# EAGLE design AD9914-shield (EAGLE 6.6.0)
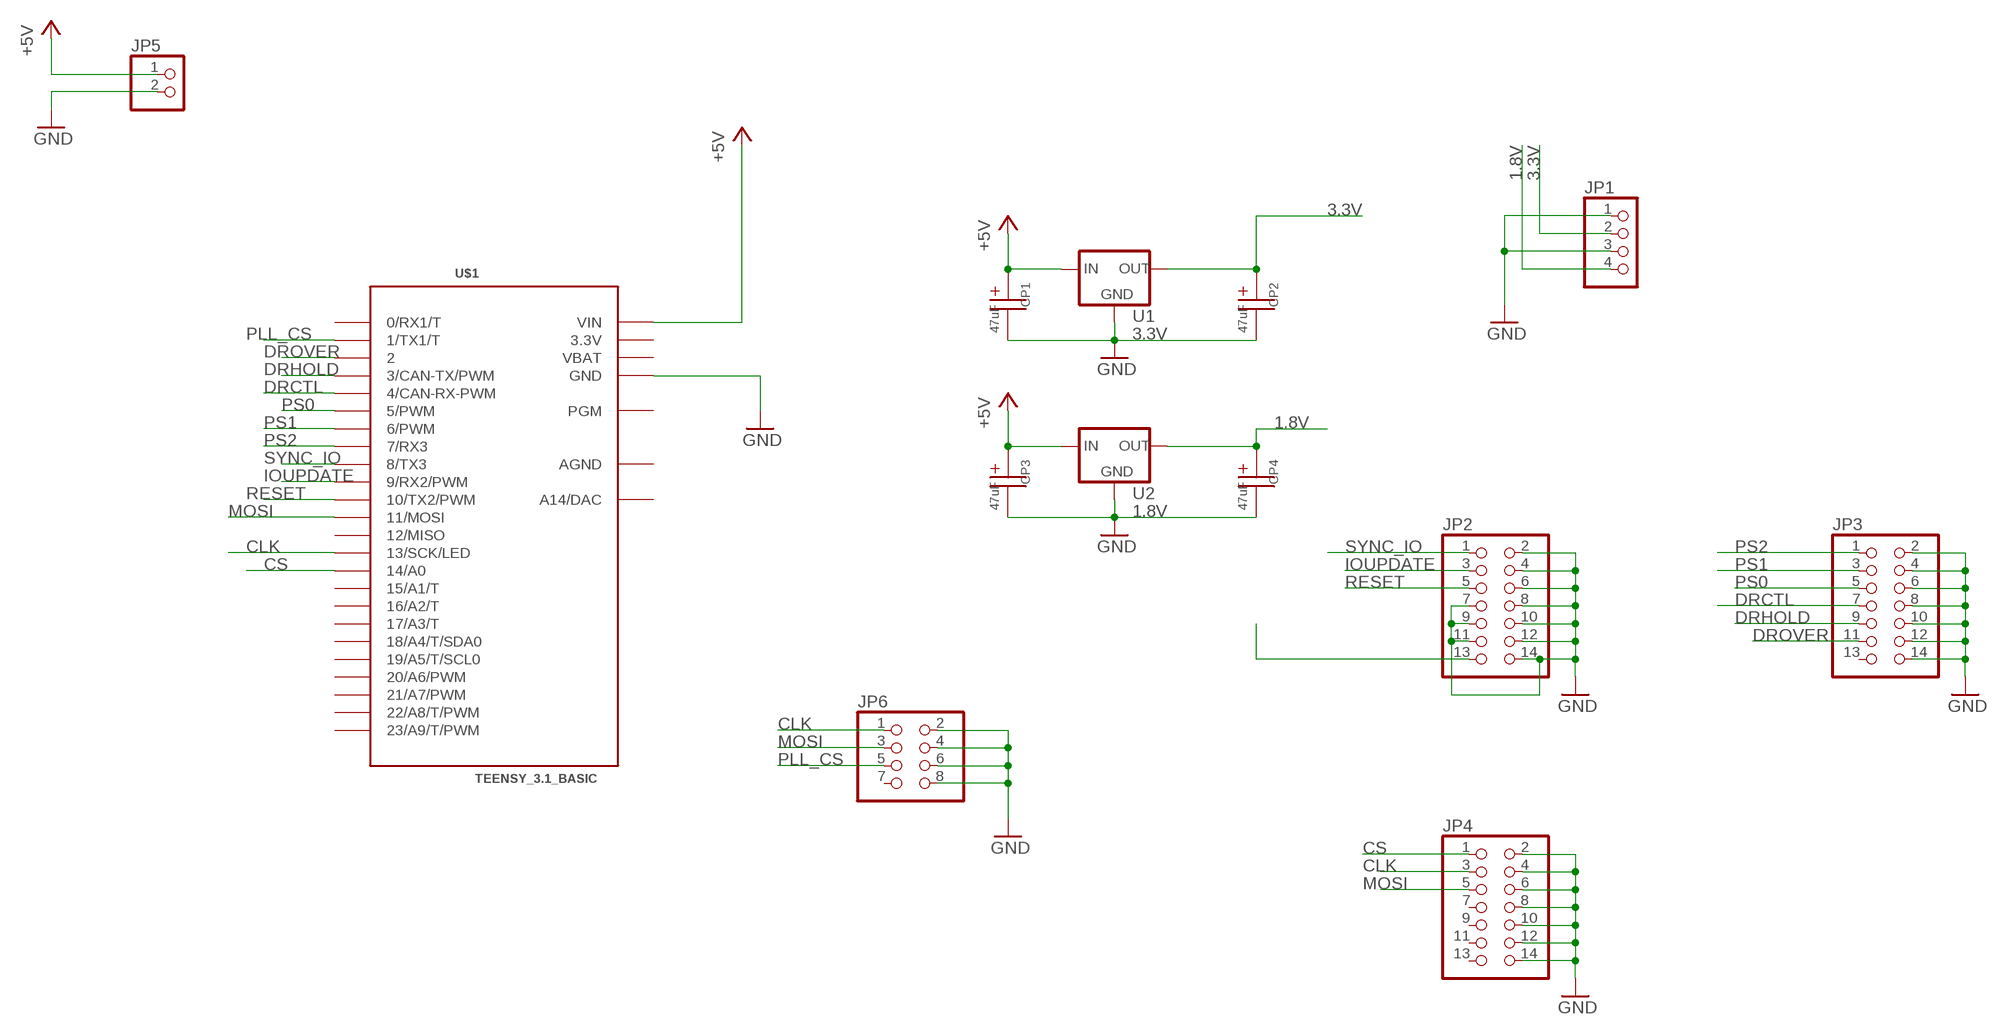
[diagram p0: schematic, sheet 1]

## Parts
CP1  47uF  CAP-POL2917  [2917P]
CP2  47uF  CAP-POL2917  [2917P]
CP3  47uF  CAP-POL2917  [2917P]
CP4  47uF  CAP-POL2917  [2917P]
JP1  PINHD-1X4  [1X04]
JP2  PINHD-2X7  [2X07]
JP3  PINHD-2X7  [2X07]
JP4  PINHD-2X7  [2X07]
JP5  PINHD-1X2  [1X02]
JP6  PINHD-2X4  [2X04]
U1  3.3V  LM1117-FIXED  [SOT223]
U2  1.8V  LM1117-FIXED  [SOT223]
U$1  TEENSY_3.1_BASIC  [TEENSY_3.1_BASIC]

## Nets
1.8V: CP4.+ JP1.4 U2.2(OUT) U2.4(OUT)
3.3V: CP2.+ JP1.2 JP2.13 U1.2(OUT) U1.4(OUT)
+5V: CP1.+ CP3.+ JP5.1 U1.3(IN) U2.3(IN) U$1.VIN
CLK: JP4.3 JP6.1 U$1.13(13/SCK/LED)
CS: JP4.1 U$1.14/A0
DRCTL: JP3.7 U$1.4(4/CAN-RX-PWM)
DRHOLD: JP3.9 U$1.3(3/CAN-TX/PWM)
DROVER: JP3.11 U$1.2
GND: CP1.- CP2.- CP3.- CP4.- JP1.1 JP1.3 JP2.2 JP2.4 JP2.6 JP2.7 JP2.8 JP2.9 JP2.10 JP2.11 JP2.12 JP2.14 JP3.2 JP3.4 JP3.6 JP3.8 JP3.10 JP3.12 JP3.14 JP4.2 JP4.4 JP4.6 JP4.8 JP4.10 JP4.12 JP4.14 JP5.2 JP6.2 JP6.4 JP6.6 JP6.8 U1.1(GND) U2.1(GND) U$1.GND U$1.GND1(GND)
IOUPDATE: JP2.3 U$1.9(9/RX2/PWM)
MOSI: JP4.5 JP6.3 U$1.11(11/MOSI)
PLL_CS: JP6.5 U$1.1(1/TX1/T)
PS0: JP3.5 U$1.5(5/PWM)
PS1: JP3.3 U$1.6(6/PWM)
PS2: JP3.1 U$1.7(7/RX3)
RESET: JP2.5 U$1.10(10/TX2/PWM)
SYNC_IO: JP2.1 U$1.8(8/TX3)
Unconnected: JP3.13 JP4.7 JP4.9 JP4.11 JP4.13 JP6.7 U$1.0(0/RX1/T) U$1.12(12/MISO) U$1.15/A1(15/A1/T) U$1.16/A2(16/A2/T) U$1.17/A3(17/A3/T) U$1.18/A4(18/A4/T/SDA0) U$1.19/A5(19/A5/T/SCL0) U$1.20/A6(20/A6/PWM) U$1.21/A7(21/A7/PWM) U$1.22/A8(22/A8/T/PWM) U$1.23/A9(23/A9/T/PWM) U$1.A14(A14/DAC) U$1.PGM

## Power pins joined to a net without a drawn wire
3.3V: U$1.3.3V U$1.3.3V1(3.3V)
AGND: U$1.AGND
VBAT: U$1.VBAT

## Library data of the parts
CP1-CP4 = rlc-jqi:CAP-POL: Polarized SMT Capacitor
JP1 = pinhead:PINHD-1X4: PIN HEADER
JP2-JP4 = pinhead:PINHD-2X7: PIN HEADER
JP5 = pinhead:PINHD-1X2: PIN HEADER
JP6 = pinhead:PINHD-2X4: PIN HEADER
U1 U2 = regulator-jqi:LM1117-FIXED
U$1 = mcu-accessories:TEENSY_3.1_BASIC: Footprint for Teensy 3.1 board using all pin connections on the outer perimeter

## Board
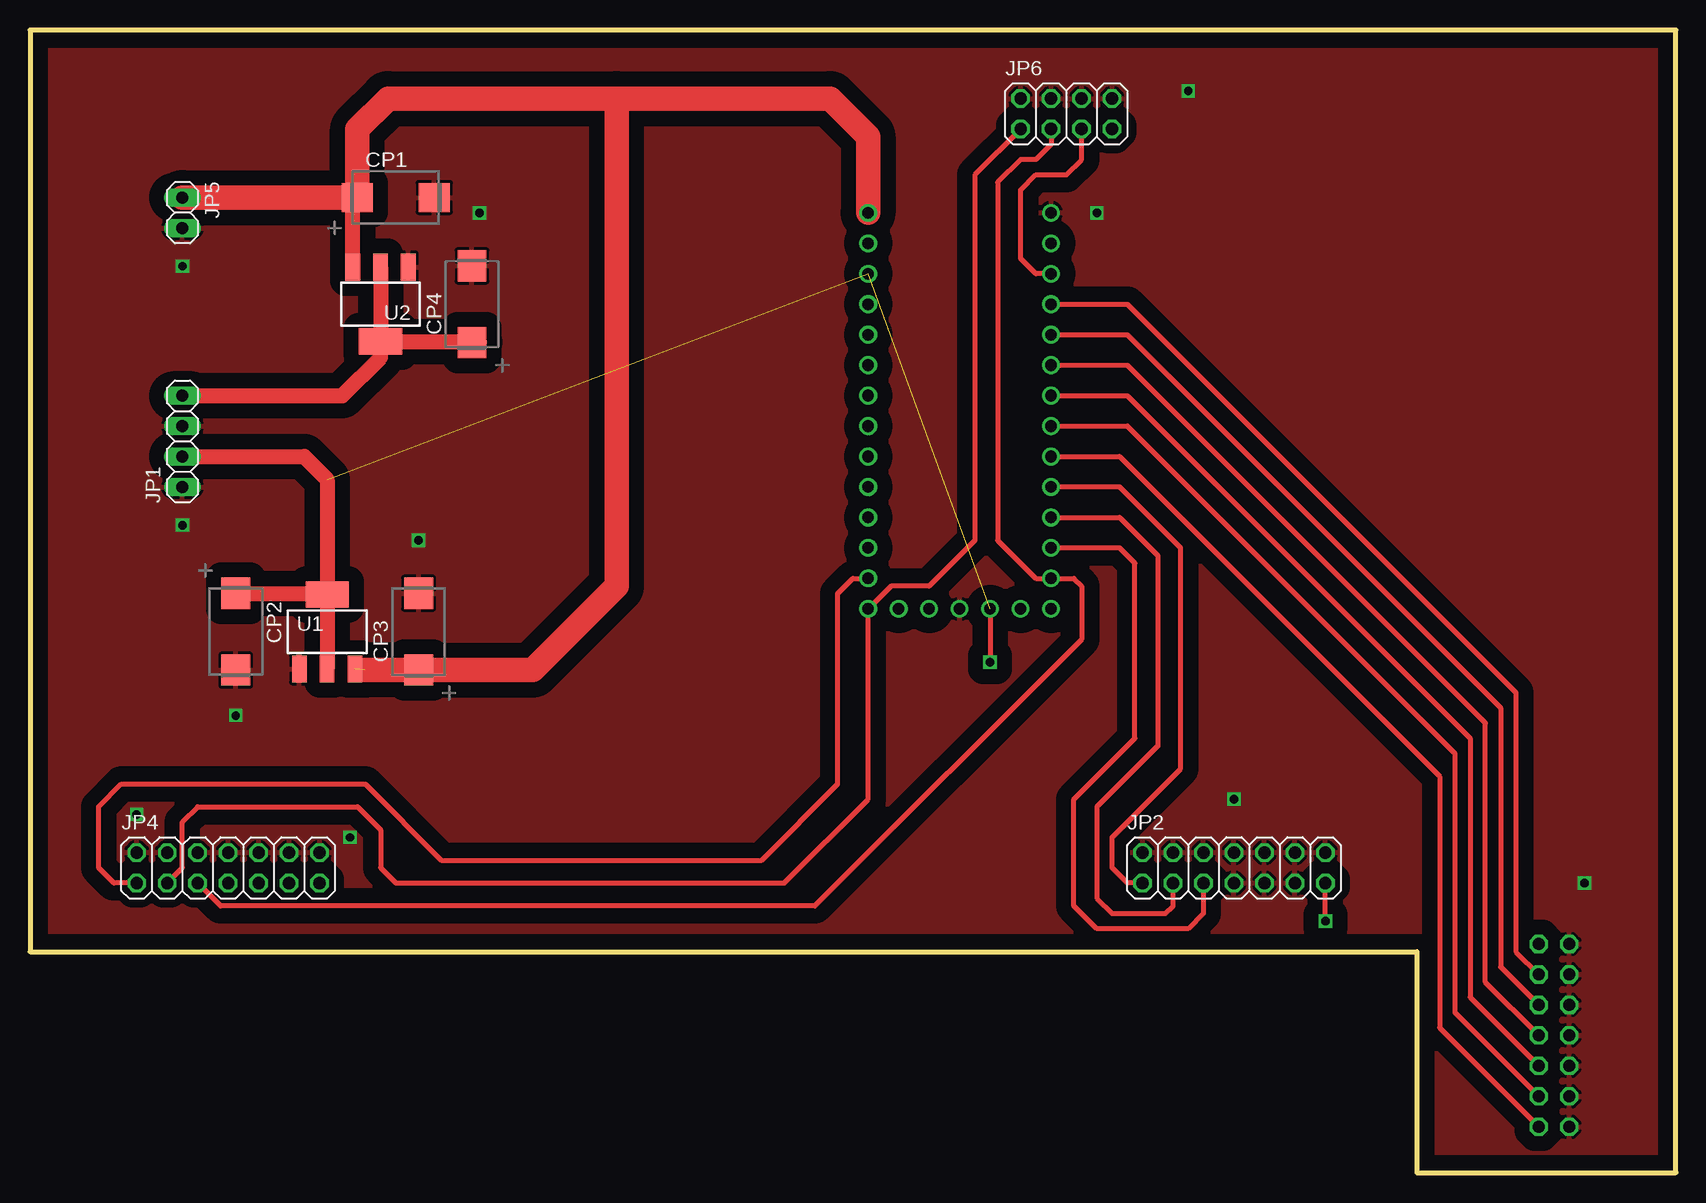
[diagram p1: board, top side]
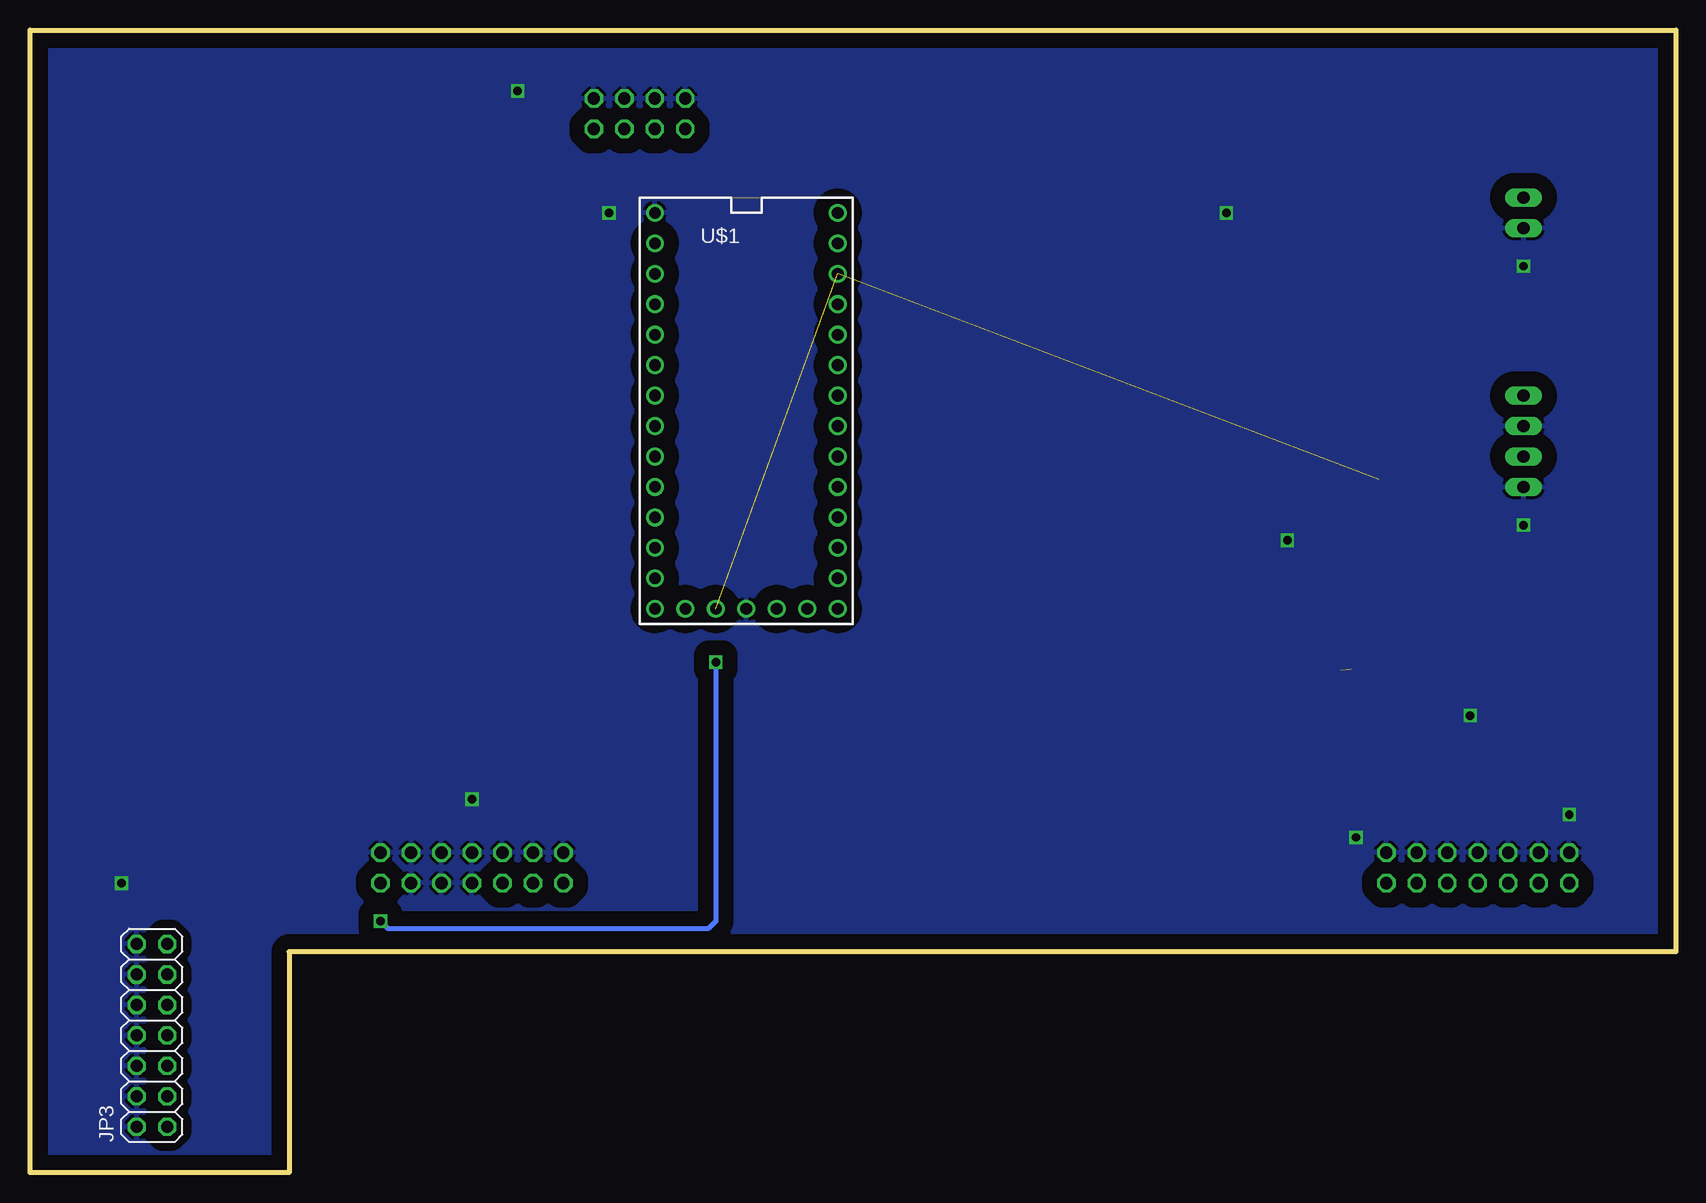
[diagram p2: board, bottom side, seen from below]

Size 137.16 x 95.25 mm. Coordinates in mm from the lower left corner, seen from the top.
Outline: 0,18.42 115.57,18.42 115.57,0 137.16,0 137.16,95.25 0,95.25 0,18.42
Copper layers (1*16): Top 0.035mm / dielectric 1.5mm / Bottom 0.035mm
Design rules "default": minimum track width 10mil, minimum drill 24mil, track to track 8mil, track to pad 8mil, pad to pad 8mil, via to via 8mil, smd to smd 8mil, copper to edge 40mil, drill to drill 8mil, minimum pad ring 10mil, minimum via ring 8mil, stop-mask expansion 4mil, vias tented up to drill 0mil, thermal gap 10mil

### Footprints (pad centres in the part's own frame; a part is rotated, then mirrored left to right if it is on the bottom)
2917P = smd 2.6 x 2.4: + -3.2,0; - 3.2,0
1X04 = drill 1.016 long: 1 -3.81,0; 2 -1.27,0; 3 1.27,0; 4 3.81,0
2X07 = drill 1.016 octagon: 1 -7.62,-1.27; 2 -7.62,1.27; 3 -5.08,-1.27; 4 -5.08,1.27; 5 -2.54,-1.27; 6 -2.54,1.27; 7 0,-1.27; 8 0,1.27; 9 2.54,-1.27; 10 2.54,1.27; 11 5.08,-1.27; 12 5.08,1.27; 13 7.62,-1.27; 14 7.62,1.27
1X02 = drill 1.016 long: 1 -1.27,0; 2 1.27,0
2X04 = drill 1.016 octagon: 1 -3.81,-1.27; 2 -3.81,1.27; 3 -1.27,-1.27; 4 -1.27,1.27; 5 1.27,-1.27; 6 1.27,1.27; 7 3.81,-1.27; 8 3.81,1.27
SOT223 = smd 1.219 x 2.235: 1 -2.311,-3.099; 2 0,-3.099; 3 2.311,-3.099 | smd 3.6 x 2.2: 4 0,3.099
TEENSY_3.1_BASIC = drill 0.965: 0 -7.62,13.97; 1 -7.62,11.43; 2 -7.62,8.89; 3 -7.62,6.35; 3.3V 7.62,11.43; 3.3V1 -2.54,-16.51; 4 -7.62,3.81; 5 -7.62,1.27; 6 -7.62,-1.27; 7 -7.62,-3.81; 8 -7.62,-6.35; 9 -7.62,-8.89; 10 -7.62,-11.43; 11 -7.62,-13.97; 12 -7.62,-16.51; 13 7.62,-16.51; 14/A0 7.62,-13.97; 15/A1 7.62,-11.43; 16/A2 7.62,-8.89; 17/A3 7.62,-6.35; 18/A4 7.62,-3.81; 19/A5 7.62,-1.27; 20/A6 7.62,1.27; 21/A7 7.62,3.81; 22/A8 7.62,6.35; 23/A9 7.62,8.89; A14 5.08,-16.51; AGND 7.62,13.97; GND -7.62,16.51; GND1 0,-16.51; PGM 2.54,-16.51; VBAT -5.08,-16.51; VIN 7.62,16.51

### Placement (x,y rotation side)
CP1  30.48,81.28 0 top
CP2  17.15,45.09 270 top
CP3  32.39,45.09 90 top
CP4  36.83,72.39 90 top
JP1  12.7,60.96 90 top
JP2  100.33,25.4 0 top
JP3  127,11.43 90 bottom
JP4  16.51,25.4 0 top
JP5  12.7,80.01 270 top
JP6  86.36,88.27 0 top
U1  24.77,45.09 0 top
U2  29.21,72.39 180 top
U$1  77.47,63.5 0 bottom

### Tracks (layer width: path | path; a pad name or v marks a point on that pad's centre or on a via)
1.8V
  Top 1.27: U2.2 U2.4 | JP1.4 26.04,64.77 29.21,67.95 U2.4 | U2.4 37.39,69.29 37.47,69.22 36.86,69.22 CP4.+
3.3V  (via drill 0.7)  (2 unrouted)
  Top 0.406: U$1.3.3V1 v80.01,42.55 | v107.95,20.95 JP2.13
  Top 1.27: JP1.2 22.86,59.69 24.77,57.78 U1.4 | U1.4 U1.2 | CP2.+ 24.66,48.28 U1.4
  Bottom 0.406: v80.01,42.55 80.01,20.95 80.65,20.32 107.32,20.32 v107.95,20.95
+5V  (1 unrouted)
  Top 1.27: U2.3 26.9,80.9 CP1.+
  Top 2.032: JP5.1 CP1.+ 27.28,86.97 29.85,89.54 48.89,89.54 | 48.89,89.54 48.89,48.89 41.89,41.89 CP3.+ 27.97,41.89 27.94,41.91 | 48.89,89.54 66.67,89.54 69.85,86.36 U$1.VIN
CLK
  Top 0.406: JP4.3 12.7,25.4 12.7,29.21 13.97,30.48 27.3,30.48 29.21,28.58 29.21,25.4 30.48,24.13 62.86,24.13 69.85,31.12 U$1.13 71.75,48.89 74.93,48.89 78.74,52.7 78.74,83.19 JP6.1
CS
  Top 0.406: JP4.1 6.99,24.13 5.72,25.4 5.72,30.48 7.62,32.39 27.94,32.39 34.29,26.03 60.96,26.03 67.31,32.39 67.31,48.26 68.58,49.53 U$1.14/A0
DRCTL
  Top 0.406: U$1.4 91.44,67.31 121.29,37.47 121.29,15.88 JP3.7
DRHOLD
  Top 0.406: U$1.3 91.44,69.85 122.56,38.73 122.56,17.14 JP3.9
DROVER
  Top 0.406: U$1.2 91.44,72.39 123.83,40.01 123.83,18.42 JP3.11
GND  (via drill 0.7)
  other vias: 100.33,31.12 129.54,24.13 88.9,80.01 37.47,80.01 32.39,52.7 17.15,38.1 12.7,53.98 12.7,75.56 26.67,27.94 8.89,29.84 96.52,90.17
  pour Top (isolate 1.27): -2.54,95.25 137.16,95.25 137.16,0 -2.54,0
  pour Bottom (isolate 1.27): -2.54,95.25 137.16,95.25 137.16,0 -2.54,0
IOUPDATE
  Top 0.406: U$1.9 90.81,54.61 93.98,51.44 93.98,35.56 88.9,30.48 88.9,22.86 90.17,21.59 94.62,21.59 95.25,22.23 JP2.3
MOSI
  Top 0.406: JP4.5 15.88,22.23 65.41,22.23 87.63,44.45 87.63,48.89 87,49.53 U$1.11 83.82,49.53 80.65,52.7 80.65,82.55 82.55,84.45 83.82,84.45 85.09,85.73 JP6.3
PLL_CS
  Top 0.406: U$1.1 83.82,74.93 82.55,76.2 82.55,81.92 83.82,83.19 86.36,83.19 87.63,84.45 JP6.5
PS0
  Top 0.406: U$1.5 91.44,64.77 120.02,36.2 120.02,14.61 JP3.5
PS1
  Top 0.406: U$1.6 91.44,62.23 118.75,34.92 118.75,13.34 JP3.3
PS2
  Top 0.406: U$1.7 90.81,59.69 117.48,33.02 117.48,12.07 JP3.1
RESET
  Top 0.406: JP2.5 97.79,21.59 96.52,20.32 88.9,20.32 87,22.23 87,31.12 92.08,36.2 92.08,50.8 90.81,52.07 U$1.10
SYNC_IO
  Top 0.406: JP2.1 91.44,24.13 90.17,25.4 90.17,27.94 95.89,33.66 95.89,52.07 90.81,57.15 U$1.8